# EAGLE design USB LEDs (EAGLE 6.3)
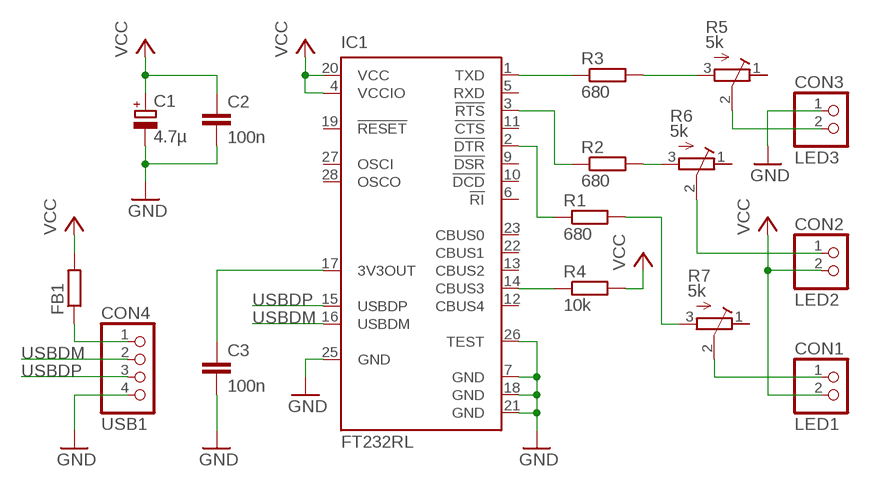
[diagram p0: schematic, sheet 1]

## Parts
C1  4.7µ  CPOL-EUR/2012-12R  [R/2012-12R]
C2  100n  C-EUC0805  [C0805]
C3  100n  C-EUC0805  [C0805]
CON1  LED1  PINHD-1X2  [1X02]
CON2  LED2  PINHD-1X2  [1X02]
CON3  LED3  PINHD-1X2  [1X02]
CON4  USB1  PINHD-1X4  [1X04]
FB1  R-EU_R0805  [R0805]
IC1  FT232RL  [SSOP28]
R1  680  R-EU_R0805  [R0805]
R2  680  R-EU_R0805  [R0805]
R3  680  R-EU_R0805  [R0805]
R4  10k  R-EU_R0805  [R0805]
R5  5k  R-TRIMM3314J  [RTRIM3314J]
R6  5k  R-TRIMM3314J  [RTRIM3314J]
R7  5k  R-TRIMM3314J  [RTRIM3314J]

## Nets
GND: C1.- C2.2 C3.2 CON3.1 CON4.4 IC1.7(GND) IC1.18(GND) IC1.21(GND) IC1.25(GND) IC1.26(TEST)
N$1: C3.1 IC1.17(3V3OUT)
N$2: CON3.2 R5.2(S)
N$3: R3.2 R5.3(A)
N$4: CON4.1 FB1.1
N$5: IC1.2(!DTR) R1.1
N$6: IC1.3(!RTS) R2.1
N$7: IC1.14(CBUS3) R4.1
N$8: CON2.1 R6.2(S)
N$9: R1.2 R7.3(A)
N$10: CON1.1 R7.2(S)
N$11: R2.2 R6.3(A)
TXD: IC1.1(TXD) R3.1
USBDM: CON4.2 IC1.16(USBDM)
USBDP: CON4.3 IC1.15(USBDP)
VCC: C1.+ C2.1 CON1.2 CON2.2 FB1.2 IC1.4(VCCIO) IC1.20(VCC) R4.2
Unconnected: IC1.5(RXD) IC1.6(!RI) IC1.9(!DSR) IC1.10(!DCD) IC1.11(!CTS) IC1.12(CBUS4) IC1.13(CBUS2) IC1.19(!RESET) IC1.22(CBUS1) IC1.23(CBUS0) IC1.27(OSCI) IC1.28(OSCO) R5.1(E) R6.1(E) R7.1(E)

## Library data of the parts
C1 = rcl:CPOL-EU: POLARIZED CAPACITOR, European symbol
C2 C3 = rcl:C-EU: CAPACITOR, European symbol
CON1-CON3 = pinhead:PINHD-1X2: PIN HEADER
CON4 = pinhead:PINHD-1X4: PIN HEADER
FB1 R1-R4 = rcl:R-EU_: RESISTOR, European symbol
IC1 = ftdichip:FT232R: Source: http://www.ftdichip.com/Documents/DataSheets/DS_FT232R_v104.pdf; MPN: FT232RL; OC_FARNELL: 1146032; OC_NEWARK: 91K9918
R5-R7 = rcl:R-TRIMM: Trimm resistor

## Board
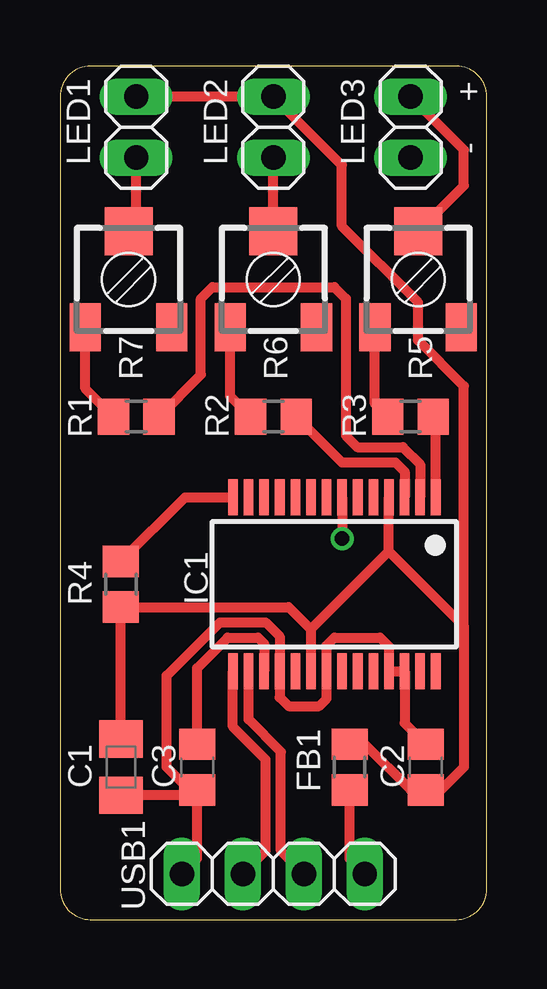
[diagram p1: board, top side]
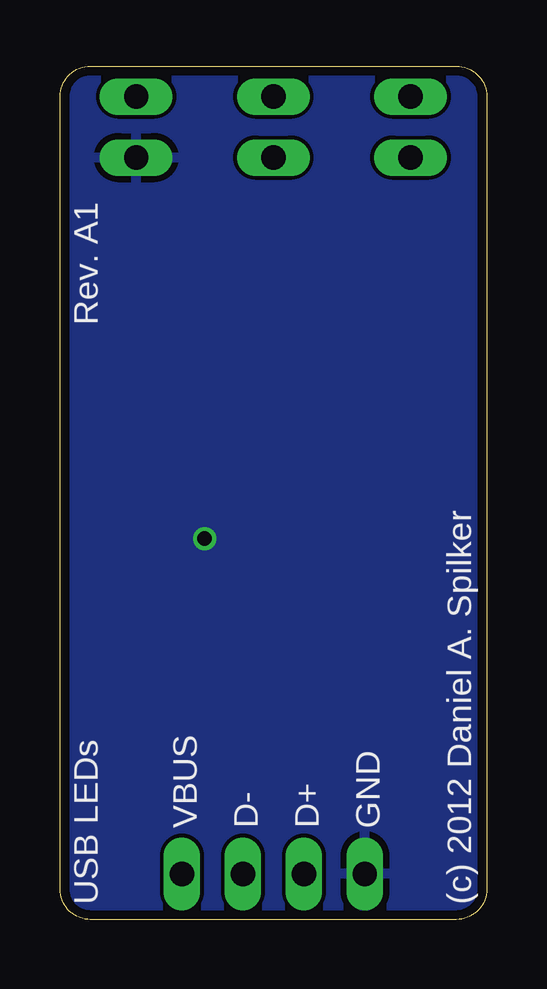
[diagram p2: board, bottom side, seen from below]

Size 17.78 x 35.56 mm. Coordinates in mm from the lower left corner, seen from the top.
Outline: 16.51,0 arc90 17.78,1.27 17.78,34.29 arc90 16.51,35.56 1.27,35.56 arc90 0,34.29 0,1.27 arc90 1.27,0 16.51,0
Copper layers (1*16): Top 0.0356mm / dielectric 1.5011mm / Bottom 0.0356mm
Design rules "default": minimum track width 6mil, minimum drill 13mil, track to track 6mil, track to pad 6mil, pad to pad 6mil, via to via 6mil, smd to smd 6mil, copper to edge 15mil, drill to drill 6mil, minimum pad ring 7mil, minimum via ring 7mil, stop-mask expansion 4mil, vias tented up to drill 0mil, thermal gap 10mil

### Footprints (pad centres in the part's own frame; a part is rotated, then mirrored left to right if it is on the bottom)
R/2012-12R = smd 1.55 x 1.8: + 1.175,0; - -1.175,0
C0805 = smd 1.3 x 1.5: 1 -0.95,0; 2 0.95,0
1X02 = drill 1.016 long: 1 -1.27,0; 2 1.27,0
1X04 = drill 1.016 long: 1 -3.81,0; 2 -1.27,0; 3 1.27,0; 4 3.81,0
R0805 = smd 1.3 x 1.5: 1 -0.95,0; 2 0.95,0
SSOP28 = smd 0.4 x 1.5: 1 -4.225,-3.625; 2 -3.575,-3.625; 3 -2.925,-3.625; 4 -2.275,-3.625; 5 -1.625,-3.625; 6 -0.975,-3.625; 7 -0.325,-3.625; 8 0.325,-3.625; 9 0.975,-3.625; 10 1.625,-3.625; 11 2.275,-3.625; 12 2.925,-3.625; 13 3.575,-3.625; 14 4.225,-3.625; 15 4.225,3.625; 16 3.575,3.625; 17 2.925,3.625; 18 2.275,3.625; 19 1.625,3.625; 20 0.975,3.625; 21 0.325,3.625; 22 -0.325,3.625; 23 -0.975,3.625; 24 -1.625,3.625; 25 -2.275,3.625; 26 -2.925,3.625; 27 -3.575,3.625; 28 -4.225,3.625
RTRIM3314J = smd 1.3 x 2: 1 1.8,-2; 3 -1.8,-2 | smd 2 x 2: 2 0,2

### Placement (x,y rotation side)
C1  2.54,6.35 90 top
C2  15.24,6.35 90 top
C3  5.71,6.35 270 top
CON1  3.17,33.02 90 top
CON2  8.89,33.02 90 top
CON3  14.61,33.02 90 top
CON4  8.89,1.91 180 top
FB1  12.06,6.35 90 top
IC1  11.43,13.97 180 top
R1  3.17,20.95 180 top
R2  8.89,20.95 180 top
R3  14.61,20.95 180 top
R4  2.54,13.97 270 top
R5  14.92,26.67 0 top
R6  8.89,26.67 0 top
R7  2.86,26.67 0 top

### Tracks (layer width: path | path; a pad name or v marks a point on that pad's centre or on a via)
GND  (via drill 0.6)
  Top 0.305: 11.11,9.2 11.11,9.21 | C3.2 5.49,5.17
  Top 0.406: 11.11,9.2 10.79,8.89 9.53,8.89 9.15,9.26 IC1.18 9.15,11.8 8.57,12.38 6.67,12.38 4.45,10.16 4.45,6.35 5.39,5.4 C3.2 5.71,2.54 CON4.4 | 11.11,9.21 IC1.21 11.11,11.42 11.43,11.75 13.34,11.75 13.71,11.38 IC1.25 IC1.26 14.36,8.19 C2.2 | 5.49,5.17 C1.- | IC1.7 v11.76,15.88
  pour Bottom: 17.78,35.56 0,35.56 0,0 17.78,0
N$1
  Top 0.406: C3.1 5.71,10.48 6.99,11.75 8.26,11.75 8.51,11.5 IC1.17
N$2
  Top 0.406: CON3.2 16.83,32.07 16.83,30.57 R5.2
N$3
  Top 0.406: R3.2 13.12,21.49 R5.3
N$4
  Top 0.406: FB1.1 12.06,2.54 CON4.1
N$5
  Top 0.406: IC1.2 15.01,18.97 14.29,19.68 12.38,19.68 11.91,20.16 11.91,25.88 11.43,26.35 6.35,26.35 5.87,25.88 5.87,22.7 R1.1
N$6
  Top 0.406: IC1.3 14.36,18.66 13.97,19.05 11.74,19.05 R2.1
N$7
  Top 0.406: IC1.14 5.21,17.59 R4.1
N$8
  Top 0.406: R6.2 CON2.1
N$9
  Top 0.406: R1.2 1.06,22.12 R7.3
N$10
  Top 0.305: R7.2 3.17,29.3
  Top 0.406: 3.17,29.3 CON1.1
N$11
  Top 0.406: R2.2 7.09,21.8 R6.3
TXD
  Top 0.305: 15.65,20.86 R3.1
  Top 0.406: IC1.1 15.65,20.86
USBDM
  Top 0.406: IC1.16 7.86,8.34 9.21,6.99 9.21,2.86 CON4.2
USBDP
  Top 0.406: IC1.15 7.21,8.04 8.57,6.67 8.57,2.86 CON4.3
VCC
  Top 0.305: 15.88,5.4 C2.1 14.61,5.4 | 12.7,7.3 FB1.2
  Top 0.406: 10.46,12.09 IC1.20 | 10.46,12.09 13.71,15.34 | 13.71,15.34 IC1.4 | CON1.2 CON2.2 11.75,31.43 11.75,28.89 14.92,25.72 14.92,24.13 16.83,22.23 16.83,12.21 | 13.71,15.34 16.83,12.21 | 16.83,12.21 16.83,6.35 15.88,5.4 | 14.61,5.4 12.7,7.3 | C1.+ R4.2 9.52,13.02 10.46,12.09

### Text on the board
tNames: + | -
bNames: Rev. A1 | GND | D+ | D- | VBUS | (c) 2012 Daniel A. Spilker | USB LEDs